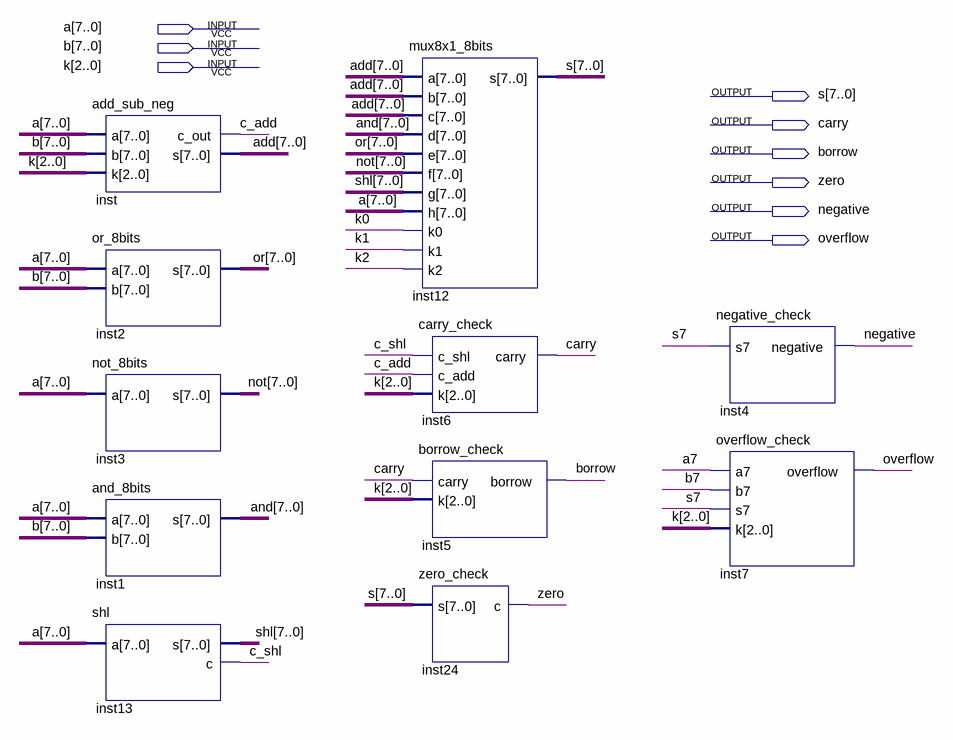
[diagram p0: schematic sheet]
// Quartus schematic ahmes_alu.bdf as structural Verilog: 11 symbols, 9 pins
module ahmes_alu (
  input  [7:0] a,
  input  [7:0] b,
  input  [2:0] k,
  output [7:0] s,
  output carry,
  output borrow,
  output zero,
  output negative,
  output overflow
);

  wire c_add, c_shl;
  wire [7:0] add, \and , \not , \or , shl;

  add_sub_neg inst (.a(a), .b(b), .k(k), .c_out(c_add), .s(add));
  or_8bits inst2 (.a(a), .b(b), .s(\or ));
  not_8bits inst3 (.a(a), .s(\not ));
  and_8bits inst1 (.a(a), .b(b), .s(\and ));
  shl inst13 (.a(a), .s(shl), .c(c_shl));
  mux8x1_8bits inst12 (
    .a(add), .b(add), .c(add), .d(\and ), .e(\or ), .f(\not ), .g(shl), .h(a), .k0(k[0]), .k1(k[1]),
    .k2(k[2]), .s(s));
  carry_check inst6 (.c_shl(c_shl), .c_add(c_add), .k(k), .carry(carry));
  borrow_check inst5 (.carry(carry), .k(k), .borrow(borrow));
  zero_check inst24 (.s(s), .c(zero));
  negative_check inst4 (.s7(s[7]), .negative(negative));
  overflow_check inst7 (.a7(a[7]), .b7(b[7]), .s7(s[7]), .k(k), .overflow(overflow));
endmodule
